# EAGLE design 16*Vibrationsdriver_PCA9685_1 (EAGLE 7.2.0)
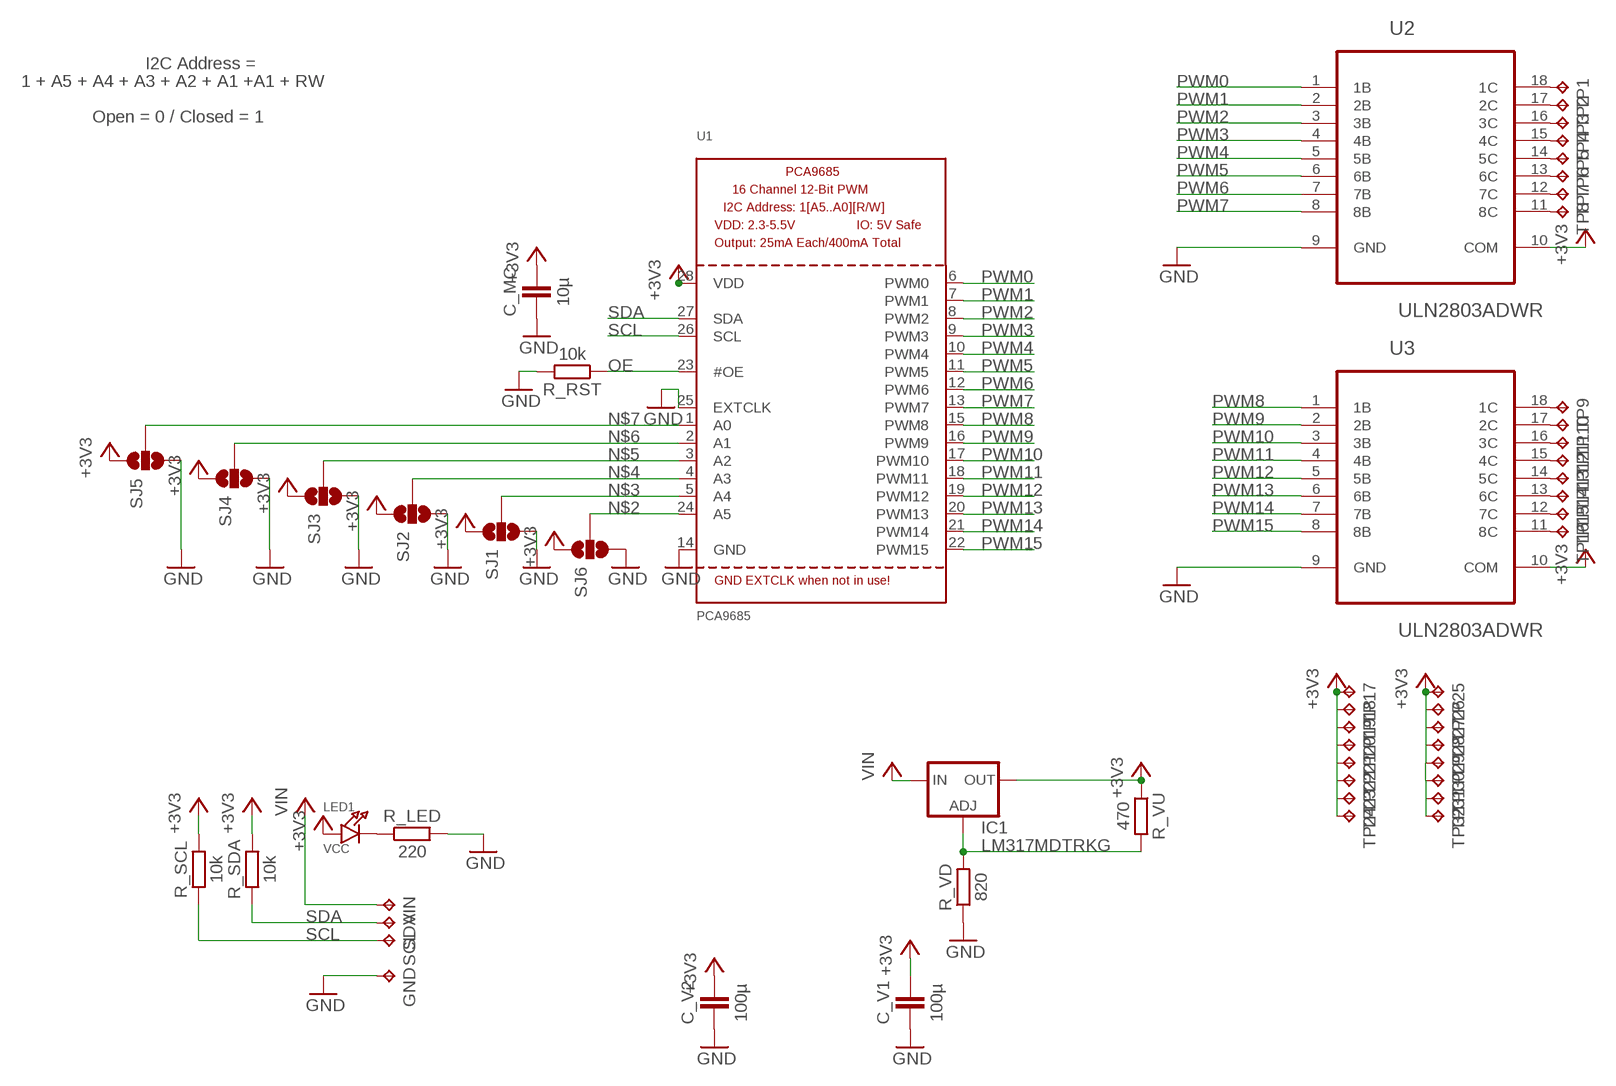
[diagram p0: schematic, sheet 1]

## Parts
C_MC  10µ  CAPACITOR  [603]
C_V1  100µ  CAPACITOR1206  [1206]
C_V2  100µ  CAPACITOR1206  [1206]
GND  TPTP16SQ  [TP16SQ]
IC1  LM317MDTRKG  [DPACK]
LED1  VCC  LED0805  [CHIPLED_0805]
R_LED  220  RESISTOR0603  [603]
R_RST  10k  RESISTOR0603  [603]
R_SCL  10k  RESISTOR0603  [603]
R_SDA  10k  RESISTOR0603  [603]
R_VD  820  RESISTOR0603  [603]
R_VU  470  RESISTOR0603  [603]
SCL  TPTP16SQ  [TP16SQ]
SDA  TPTP16SQ  [TP16SQ]
SJ1  SOLDERJUMPER_2WAYPASTE2&3  [SJ_3_PASTE2&3]
SJ2  SOLDERJUMPER_2WAYPASTE2&3  [SJ_3_PASTE2&3]
SJ3  SOLDERJUMPER_2WAYPASTE2&3  [SJ_3_PASTE2&3]
SJ4  SOLDERJUMPER_2WAYPASTE2&3  [SJ_3_PASTE2&3]
SJ5  SOLDERJUMPER_2WAYPASTE2&3  [SJ_3_PASTE2&3]
SJ6  SOLDERJUMPER_2WAYPASTE2&3  [SJ_3_PASTE2&3]
TP1  TPTP16SQ  [TP16SQ]
TP2  TPTP16SQ  [TP16SQ]
TP3  TPTP16SQ  [TP16SQ]
TP4  TPTP16SQ  [TP16SQ]
TP5  TPTP16SQ  [TP16SQ]
TP6  TPTP16SQ  [TP16SQ]
TP7  TPTP16SQ  [TP16SQ]
TP8  TPTP16SQ  [TP16SQ]
TP9  TPTP16SQ  [TP16SQ]
TP10  TPTP16SQ  [TP16SQ]
TP11  TPTP16SQ  [TP16SQ]
TP12  TPTP16SQ  [TP16SQ]
TP13  TPTP16SQ  [TP16SQ]
TP14  TPTP16SQ  [TP16SQ]
TP15  TPTP16SQ  [TP16SQ]
TP16  TPTP16SQ  [TP16SQ]
TP17  TPTP16SQ  [TP16SQ]
TP18  TPTP16SQ  [TP16SQ]
TP19  TPTP16SQ  [TP16SQ]
TP20  TPTP16SQ  [TP16SQ]
TP21  TPTP16SQ  [TP16SQ]
TP22  TPTP16SQ  [TP16SQ]
TP23  TPTP16SQ  [TP16SQ]
TP24  TPTP16SQ  [TP16SQ]
TP25  TPTP16SQ  [TP16SQ]
TP26  TPTP16SQ  [TP16SQ]
TP27  TPTP16SQ  [TP16SQ]
TP28  TPTP16SQ  [TP16SQ]
TP29  TPTP16SQ  [TP16SQ]
TP30  TPTP16SQ  [TP16SQ]
TP31  TPTP16SQ  [TP16SQ]
TP32  TPTP16SQ  [TP16SQ]
U1  PCA9685  [TSSOP28]
U2  ULN2803ADWR  [SOIC127P1030X265-18N]
U3  ULN2803ADWR  [SOIC127P1030X265-18N]
VIN  TPTP16SQ  [TP16SQ]

## Nets
+3V3: C_MC.2 C_V1.2 C_V2.2 IC1.4(OUT) LED1.A R_SCL.2 R_SDA.2 R_VU.1 SJ1.1 SJ2.1 SJ3.1 SJ4.1 SJ5.1 SJ6.1 TP17.TP TP18.TP TP19.TP TP20.TP TP21.TP TP22.TP TP23.TP TP24.TP TP25.TP TP26.TP TP27.TP TP28.TP TP29.TP TP30.TP TP31.TP TP32.TP U1.28(VDD) U2.10(COM) U3.10(COM)
GND: C_MC.1 C_V1.1 C_V2.1 GND.TP R_LED.2 R_RST.2 R_VD.1 SJ1.3 SJ2.3 SJ3.3 SJ4.3 SJ5.3 SJ6.3 U1.14(GND) U1.25(EXTCLK) U2.9(GND) U3.9(GND)
N$1: LED1.C R_LED.1
N$2: SJ6.2 U1.24(A5)
N$3: SJ1.2 U1.5(A4)
N$4: SJ2.2 U1.4(A3)
N$5: SJ3.2 U1.3(A2)
N$6: SJ4.2 U1.2(A1)
N$7: SJ5.2 U1.1(A0)
N$14: TP1.TP U2.18(1C)
N$18: IC1.1(ADJ) R_VD.2 R_VU.2
N$19: TP2.TP U2.17(2C)
N$20: TP3.TP U2.16(3C)
N$21: TP4.TP U2.15(4C)
N$22: TP5.TP U2.14(5C)
N$23: TP6.TP U2.13(6C)
N$24: TP7.TP U2.12(7C)
N$25: TP8.TP U2.11(8C)
N$26: TP9.TP U3.18(1C)
N$27: TP10.TP U3.17(2C)
N$28: TP11.TP U3.16(3C)
N$29: TP12.TP U3.15(4C)
N$30: TP13.TP U3.14(5C)
N$31: TP14.TP U3.13(6C)
N$32: TP15.TP U3.12(7C)
N$33: TP16.TP U3.11(8C)
OE: R_RST.1 U1.23(#OE)
PWM0: U1.6(PWM0) U2.1(1B)
PWM1: U1.7(PWM1) U2.2(2B)
PWM2: U1.8(PWM2) U2.3(3B)
PWM3: U1.9(PWM3) U2.4(4B)
PWM4: U1.10(PWM4) U2.5(5B)
PWM5: U1.11(PWM5) U2.6(6B)
PWM6: U1.12(PWM6) U2.7(7B)
PWM7: U1.13(PWM7) U2.8(8B)
PWM8: U1.15(PWM8) U3.1(1B)
PWM9: U1.16(PWM9) U3.2(2B)
PWM10: U1.17(PWM10) U3.3(3B)
PWM11: U1.18(PWM11) U3.4(4B)
PWM12: U1.19(PWM12) U3.5(5B)
PWM13: U1.20(PWM13) U3.6(6B)
PWM14: U1.21(PWM14) U3.7(7B)
PWM15: U1.22(PWM15) U3.8(8B)
SCL: R_SCL.1 SCL.TP U1.26(SCL)
SDA: R_SDA.1 SDA.TP U1.27(SDA)
VCC: IC1.3(IN) VIN.TP ; supply symbol labelled VIN

## Notes on the sheet
- I2C Address =
- 1 + A5 + A4 + A3 + A2 + A1 +A1 + RW
- Open = 0 / Closed = 1

## Library data of the parts
C_MC C_V1 C_V2 = thar:CAPACITOR
GND SCL SDA TP1-TP32 VIN = testpad:TP: Test pad
IC1 = v-reg:LM317?*: 500 mA Adjustable Output Positive Voltage Regulator Source: http://www.onsemi.co.jp .. LM317M-D.PDF
LED1 = microbuilder:LED: LED 0603 - 0603 Surface Mount Package 2mA: Green LED - Low Power (3.9mcd, 2ma, 1.7Vf) - Digikey: 475-2709-2-ND Orange LED - Low Power (9.8mcd, 2ma, 1.8Vf) - Digikey: 475-1194-2-ND Red LED - Low Power (5mcd, 2ma, 1.8Vf) - Digikey: 475-1195-2-ND Yellow LED - Low Power (7mcd, 2ma, 1.8Vf) - Digikey: 475-1196-2-ND 5mA: Blue LED - Low Power (17mcd, 5ma, 2.9Vf) - Digikey: LNJ937W8CRACT-ND 0805 - 0805 Surface Mount Package 2mA: Red LED (8.8mcd, 2mA, 1.8Vf, Clear) - Low Power [Digikey: 475-2510-1-ND] Green LED (5mcd, 2mA, 1.8Vf, Clear) - Low Power [Digikey: 475-2730-1-ND] Yellow LED (11.3mcd, 2mA, 1.8Vf, Clear) - Low Power [Digikey: 475-2555-1-ND] 20mA: Red LED (104mcd, 20mA, Diffused) - LS R976 [Digikey: 475-1278-6-ND] Red LED (12mcd, 20mA, 2.0Vf, Clear) - APT2012EC [Digikey: 754-1128-1-ND] Green LED (15mcd, 20mA, 2.2Vf, Clear) - APT2012GC [Digikey: 754-1131-1-ND] Orange LED (160mcd, 20mA, 2.1Vf, Clear) - APT2012SECK [Digikey: 754-1130-1-ND] 1206 - 1206 Surface Mount Package Green LED (26mcd, 20mA, Diffused) - LG N971 [Digikey: 475-1407-6-ND] Red LED (15mcd, 20mA, Diffused) - LH N974 [Digikey: 475-1416-6-ND]
R_LED R_RST R_SCL R_SDA R_VD R_VU = thar:RESISTOR
SJ1-SJ6 = SparkFun-Retired:SOLDERJUMPER_2WAY: Solder Jumper 2 way solder jumper
U1 = microbuilder:PCA9685: PCA9685 - 16 Channel 12-Bit I2C PWM Controller 5.0V tolerant 16 channel, 12-bit I2C PWM controller with 25mA per output (max. 400mA total) Digikey: 568-5931-1-ND
U2 U3 = TI_ULN2803:ULN2803ADWR: Darlington transistor array; MPN: ULN2803ADWR; OC_FARNELL: 1652420; OC_NEWARK: 87H4769; PACKAGE: SOIC-18; SUPPLIER: TEXAS INSTRUMENTS

## Board
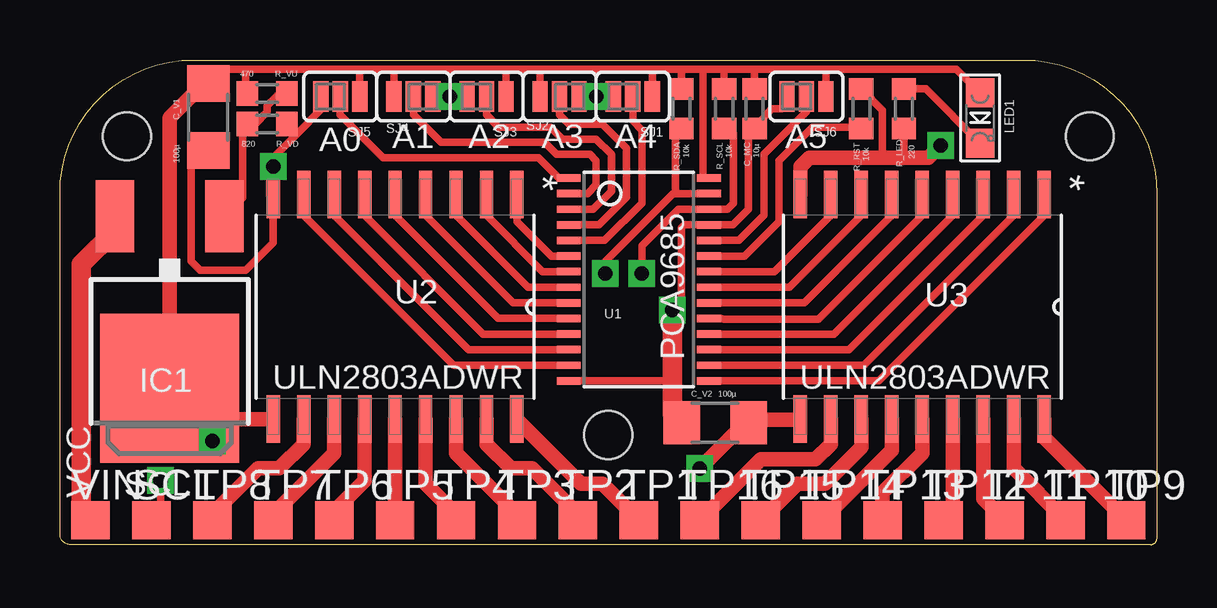
[diagram p1: board, top side]
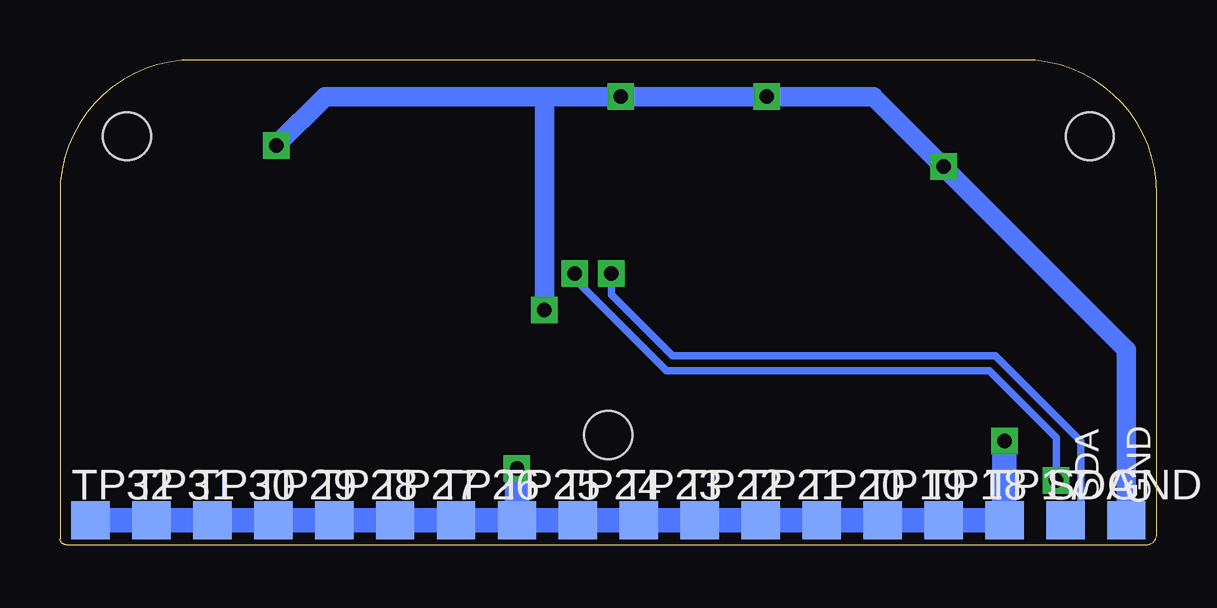
[diagram p2: board, bottom side, seen from below]

Size 45.72 x 20.19 mm. Coordinates in mm from the lower left corner, seen from the top.
Outline: 0.38,0 arc-74 0,0.38 0,14.61 arc-91 5.59,20.19 40.13,20.19 arc-91 45.72,14.61 45.72,0.25 arc-90 45.47,0 0.38,0
Copper layers (1*16): Top 0.035mm / dielectric 1.5mm / Bottom 0.035mm
Design rules "PCBCart-Standard": minimum track width 8mil, minimum drill 0.4mm, track to track 8mil, track to pad 8mil, pad to pad 8mil, via to via 8mil, smd to smd 8mil, copper to edge 20mil, drill to drill 8mil, minimum pad ring 8mil, minimum via ring 10mil, stop-mask expansion 3mil, vias tented up to drill 20mil, thermal gap 8mil
Holes 2 mm at 2.79,17.02 42.93,17.02 22.86,4.57

### Footprints (pad centres in the part's own frame; a part is rotated, then mirrored left to right if it is on the bottom)
603 = smd 0.889 x 1.016: 1 -0.826,0; 2 0.826,0
1206 = smd 1.524 x 1.778: 1 -1.397,0; 2 1.397,0
TP16SQ = smd 1.6 x 1.6: TP 0,0
DPACK = smd 1.6 x 3: 1 -2.28,-4.8; 3 2.28,-4.8 | smd 5.8 x 6.2: 4 0,2.38
CHIPLED_0805 = smd 1.2 x 1.2: A 0,-1.05; C 0,1.05
SJ_3_PASTE2&3 = smd 0.635 x 1.27: 1 -0.813,0; 2 0,0; 3 0.813,0
TSSOP28 = smd 0.305 x 0.991: 1 -4.225,-2.918; 2 -3.575,-2.918; 3 -2.925,-2.918; 4 -2.275,-2.918; 5 -1.625,-2.918; 6 -0.975,-2.918; 7 -0.325,-2.918; 8 0.325,-2.918; 9 0.975,-2.918; 10 1.625,-2.918; 11 2.275,-2.918; 12 2.925,-2.918; 13 3.575,-2.918; 14 4.225,-2.918; 15 4.225,2.918; 16 3.575,2.918; 17 2.925,2.918; 18 2.275,2.918; 19 1.625,2.918; 20 0.975,2.918; 21 0.325,2.918; 22 -0.325,2.918; 23 -0.975,2.918; 24 -1.625,2.918; 25 -2.275,2.918; 26 -2.925,2.918; 27 -3.575,2.918; 28 -4.225,2.918
SOIC127P1030X265-18N = smd 1.981 x 0.559: 1 -4.674,5.08; 2 -4.674,3.81; 3 -4.674,2.54; 4 -4.674,1.27; 5 -4.674,0; 6 -4.674,-1.27; 7 -4.674,-2.54; 8 -4.674,-3.81; 9 -4.674,-5.08; 10 4.674,-5.08; 11 4.674,-3.81; 12 4.674,-2.54; 13 4.674,-1.27; 14 4.674,0; 15 4.674,1.27; 16 4.674,2.54; 17 4.674,3.81; 18 4.674,5.08

### Placement (x,y rotation side)
C_MC  28.96,18.16 90 top
C_V1  6.19,17.82 90 top
C_V2  27.31,5.08 0 top
GND  1.27,1.02 0 bottom
IC1  4.57,8.89 180 top
LED1  38.35,17.78 180 top
R_LED  35.18,18.16 270 top
R_RST  33.4,18.16 90 top
R_SCL  27.69,18.16 90 top
R_SDA  25.91,18.16 90 top
R_VD  8.64,17.53 180 top
R_VU  8.64,18.8 0 top
SCL  3.81,1.02 0 top
SDA  3.81,1.02 0 bottom
SJ1  23.88,18.67 180 top
SJ2  20.83,18.67 0 top
SJ3  17.78,18.67 180 top
SJ4  14.73,18.67 0 top
SJ5  11.68,18.67 180 top
SJ6  31.11,18.67 180 top
TP1  24.13,1.02 0 top
TP2  21.59,1.02 0 top
TP3  19.05,1.02 0 top
TP4  16.51,1.02 0 top
TP5  13.97,1.02 0 top
TP6  11.43,1.02 0 top
TP7  8.89,1.02 0 top
TP8  6.35,1.02 0 top
TP9  44.45,1.02 0 top
TP10  41.91,1.02 0 top
TP11  39.37,1.02 0 top
TP12  36.83,1.02 0 top
TP13  34.29,1.02 0 top
TP14  31.75,1.02 0 top
TP15  29.21,1.02 0 top
TP16  26.67,1.02 0 top
TP17  6.35,1.02 0 bottom
TP18  8.89,1.02 0 bottom
TP19  11.43,1.02 0 bottom
TP20  13.97,1.02 0 bottom
TP21  16.51,1.02 0 bottom
TP22  19.05,1.02 0 bottom
TP23  21.59,1.02 0 bottom
TP24  24.13,1.02 0 bottom
TP25  26.67,1.02 0 bottom
TP26  29.21,1.02 0 bottom
TP27  31.75,1.02 0 bottom
TP28  34.29,1.02 0 bottom
TP29  36.83,1.02 0 bottom
TP30  39.37,1.02 0 bottom
TP31  41.91,1.02 0 bottom
TP32  44.45,1.02 0 bottom
U1  24.13,11.05 270 top
U2  13.97,9.91 270 top
U3  35.94,9.91 270 top
VIN  1.27,1.02 0 top

### Tracks (layer width: path | path; a pad name or v marks a point on that pad's centre or on a via)
+3V3  (via drill 0.6)
  Top 0.305: 30.71,5.21 U3.10 | 27.69,19.81 28.96,19.81 | C_MC.2 28.96,19.81 | R_SDA.2 25.91,19.81 | 27.69,19.81 26.8,19.81 | 26.8,19.81 25.91,19.81 | 7.75,19.81 12.45,19.81 | 12.45,19.81 13.92,19.81 | 13.92,19.81 18.59,19.81 | 18.59,19.81 19.94,19.81 | 19.94,19.81 24.64,19.81 | 24.64,19.81 25.91,19.81 | R_SCL.2 27.69,19.81 | 27.68,19.81 27.69,19.81 | U2.10 4.55,5.23 4.45,5.33 | U1.28 26.76,15.27 26.8,15.37 26.8,19.81 | SJ2.1 20.02,19.74 19.94,19.81 | SJ1.1 24.69,19.76 24.64,19.81 | SJ4.1 13.92,19.81 | SJ3.1 18.59,19.81 | SJ5.1 12.5,19.76 12.45,19.81 | R_VU.1 7.75,18.8 7.75,19.81 | C_V1.2 5.93,19.14 5.97,19.18 6.6,19.81 7.75,19.81 | 28.96,19.81 31.88,19.81 | 31.88,19.81 37.37,19.81 LED1.A | SJ6.1 31.93,19.76 31.88,19.81
  Top 0.61: U2.10 3.96,5.23 3.81,5.08 | 30.71,5.21 28.7,5.21 28.64,5.14 v26.67,3.17 | C_V1.2 5.97,19.18 4.57,17.78 IC1.4
  Top 0.813: C_V2.2 28.64,5.14
  Top 1.016: 4.45,5.33 v6.35,4.32
  Top 1.27: IC1.4 4.16,6.76 4.06,7.62 4.06,6.35 4.32,6.6
  Top 1.422: 4.32,6.6 3.81,5.08
  Bottom 1.016: TP18.TP TP17.TP v6.35,4.32 | TP25.TP TP24.TP TP23.TP TP22.TP TP21.TP TP20.TP TP19.TP TP18.TP | v26.67,3.17 TP25.TP | TP25.TP TP26.TP TP27.TP TP28.TP TP29.TP TP30.TP TP31.TP TP32.TP | TP18.TP 9.02,0.89 | 8.64,1.27 TP18.TP
GND  (via drill 0.6)
  Top 0.305: 9.4,17.78 R_VD.1 | R_VD.1 9.53,17.84 9.53,17.53 9.91,17.14 | R_VD.1 9.53,17.78 | SJ6.3 30.3,18.36 30.1,18.16 29.65,18.16 C_MC.1 28.7,17.21 28.7,13.97 28.06,13.32 U1.25 26.02,13.32 25.91,13.21 25.91,10.16 v25.53,9.78 25.62,6.82 U1.14 | SJ1.3 v22.35,18.67 SJ2.3 | SJ3.3 v16.26,18.67 SJ4.3 | SJ5.3 10.87,18.11 9.91,17.14 | 9.91,17.14 8.89,16.13 v8.89,15.75 | 6.19,16.47 6.19,16.22 5.46,16.13 5.46,11.81 5.84,11.43 7.75,11.43 8.89,12.57 U2.9 | 34.29,16.13 34.29,18.1 R_RST.2 | R_LED.2 35.18,16.13
  Top 0.61: U2.9 v8.89,15.75 | U3.9 30.86,15.75 31.24,16.13 34.29,16.13 35.18,16.13 36.2,16.13 v36.7,16.64 | C_V1.1 6.19,16.47
  Top 0.813: v25.53,9.78 25.53,5.44 25.89,5.08 C_V2.1
  Bottom 0.813: 25.53,18.67 v22.35,18.67 v16.26,18.67 11.81,18.67 v8.89,15.75 1.27,8.13 GND.TP | 25.53,18.67 34.67,18.67 v36.7,16.64 | v25.53,9.78 25.53,18.67
N$1
  Top 0.305: LED1.C 36.1,18.99 R_LED.1
N$2
  Top 0.305: U1.24 28.29,12.67 29.34,13.72 29.34,16.26 31.11,18.03 SJ6.2
N$3
  Top 0.305: U1.5 22.71,12.67 24.26,14.22 24.26,17.27 23.88,17.65 SJ1.2
N$4
  Top 0.305: U1.4 22.47,13.32 23.62,14.48 23.62,16.51 22.61,17.53 21.21,17.53 20.83,17.91 SJ2.2
N$5
  Top 0.305: U1.3 22.23,13.97 22.99,14.73 22.99,16.26 22.35,16.89 20.96,16.89 20.45,17.4 18.29,17.4 17.78,17.91 SJ3.2
N$6
  Top 0.305: U1.2 21.99,14.62 22.35,14.99 22.35,16 22.1,16.26 20.7,16.26 20.19,16.76 15.88,16.76 14.73,17.91 SJ4.2
N$7
  Top 0.305: U1.1 20.79,15.27 19.94,16.13 13.46,16.13 11.68,17.91 SJ5.2
N$14
  Top 0.61: 24.13,1.27 TP1.TP 22.61,2.54 21.72,2.54 19.05,5.21 U2.18
N$18
  Top 0.305: 6.73,14.08 7.37,14.08 7.11,13.7 IC1.1 7.62,14.46 7.62,17.65 7.68,17.65 R_VD.2 8.13,17.53 8.64,18.03 8.64,18.29 9.14,18.8 R_VU.2
N$19
  Top 0.61: TP2.TP 21.59,1.27 19.69,3.17 18.8,3.17 17.78,4.19 U2.17
N$20
  Top 0.61: TP3.TP 19.05,1.27 16.51,3.81 U2.16
N$21
  Top 0.61: TP4.TP 16.51,1.27 15.24,2.54 U2.15
N$22
  Top 0.61: U2.14 TP5.TP
N$23
  Top 0.61: TP6.TP 11.43,1.4 12.7,2.67 U2.13
N$24
  Top 0.61: TP7.TP 8.89,1.27 11.43,3.81 U2.12
N$25
  Top 0.61: TP8.TP 6.35,1.27 8.25,3.17 9.14,3.17 10.16,4.19 U2.11
N$26
  Top 0.61: U3.18 41.02,4.44 TP9.TP
N$27
  Top 0.61: U3.17 39.75,3.17 TP10.TP
N$28
  Top 0.61: U3.16 38.48,1.91 TP11.TP
N$29
  Top 0.61: U3.15 37.21,1.4 TP12.TP
N$30
  Top 0.61: U3.14 35.94,3.81 34.29,2.16 TP13.TP
N$31
  Top 0.61: U3.13 34.67,3.94 TP14.TP
N$32
  Top 0.61: U3.12 33.4,4.06 31.88,2.54 30.73,2.54 TP15.TP
N$33
  Top 0.61: U3.11 32.13,4.19 31.5,3.56 29.21,3.56 TP16.TP
OE
  Top 0.305: U1.23 28.53,12.02 29.97,13.46 29.97,16 31.37,17.4 33.34,17.4 R_RST.1
PWM0
  Top 0.305: U1.6 20.49,12.02 19.05,13.46 U2.1
PWM1
  Top 0.305: U1.7 20.12,11.37 17.78,13.72 U2.2
PWM2
  Top 0.305: U1.8 19.5,10.72 16.51,13.72 U2.3
PWM3
  Top 0.305: U1.9 18.88,10.07 15.24,13.72 U2.4
PWM4
  Top 0.305: U1.10 18.26,9.42 13.97,13.72 U2.5
PWM5
  Top 0.305: U1.11 17.64,8.77 12.7,13.72 U2.6
PWM6
  Top 0.305: U1.12 17.02,8.12 11.43,13.72 U2.7
PWM7
  Top 0.305: U1.13 16.4,7.47 10.16,13.72 U2.8
PWM8
  Top 0.305: U1.15 34.13,6.82 41.02,13.72 U3.1
PWM9
  Top 0.305: U1.16 33.51,7.47 39.75,13.72 U3.2
PWM10
  Top 0.305: U1.17 32.89,8.12 38.48,13.72 U3.3
PWM11
  Top 0.305: U3.4 37.21,13.72 32.27,8.77 U1.18
PWM12
  Top 0.305: U3.5 35.94,13.72 31.62,9.4 27.69,9.4 27.53,9.42 U1.19
PWM13
  Top 0.305: U1.20 31.03,10.07 34.67,13.72 U3.6
PWM14
  Top 0.305: U1.21 30.41,10.72 33.4,13.72 U3.7
PWM15
  Top 0.305: U1.22 29.79,11.37 32.13,13.72 U3.8
SCL  (via drill 0.6)
  Top 0.305: v24.26,11.3 24.26,12.45 25.79,13.97 U1.26 27.82,13.97 28.07,14.22 28.07,17.14 27.69,17.53 R_SCL.1 | SCL.TP 3.81,1.4 4.19,1.4 v4.19,2.67
  Bottom 0.305: v24.26,11.3 24.26,11.05 20.45,7.24 6.98,7.24 4.19,4.44 v4.19,2.67
SDA  (via drill 0.6)
  Top 0.305: v22.73,11.3 22.73,11.81 25.55,14.62 25.65,14.62 | 25.65,14.62 U1.27 | R_SDA.1 25.65,17.46 25.65,14.62
  Bottom 0.305: v22.73,11.3 22.73,10.41 20.19,7.87 6.73,7.87 3.18,4.32 3.18,1.02 SDA.TP
VCC
  Top 0.813: IC1.3 2.29,13.08 | 2.29,13.08 2.29,12.96 | 2.29,13.08 0.89,11.68 0.89,1.4 VIN.TP

### Text on the board
tPlace: A0 | A1 | A2 | A3 | A4 | A5 | VCC | SCL
bPlace: GND | SDA